# EAGLE design EtherGeiger (EAGLE 7.7.0)
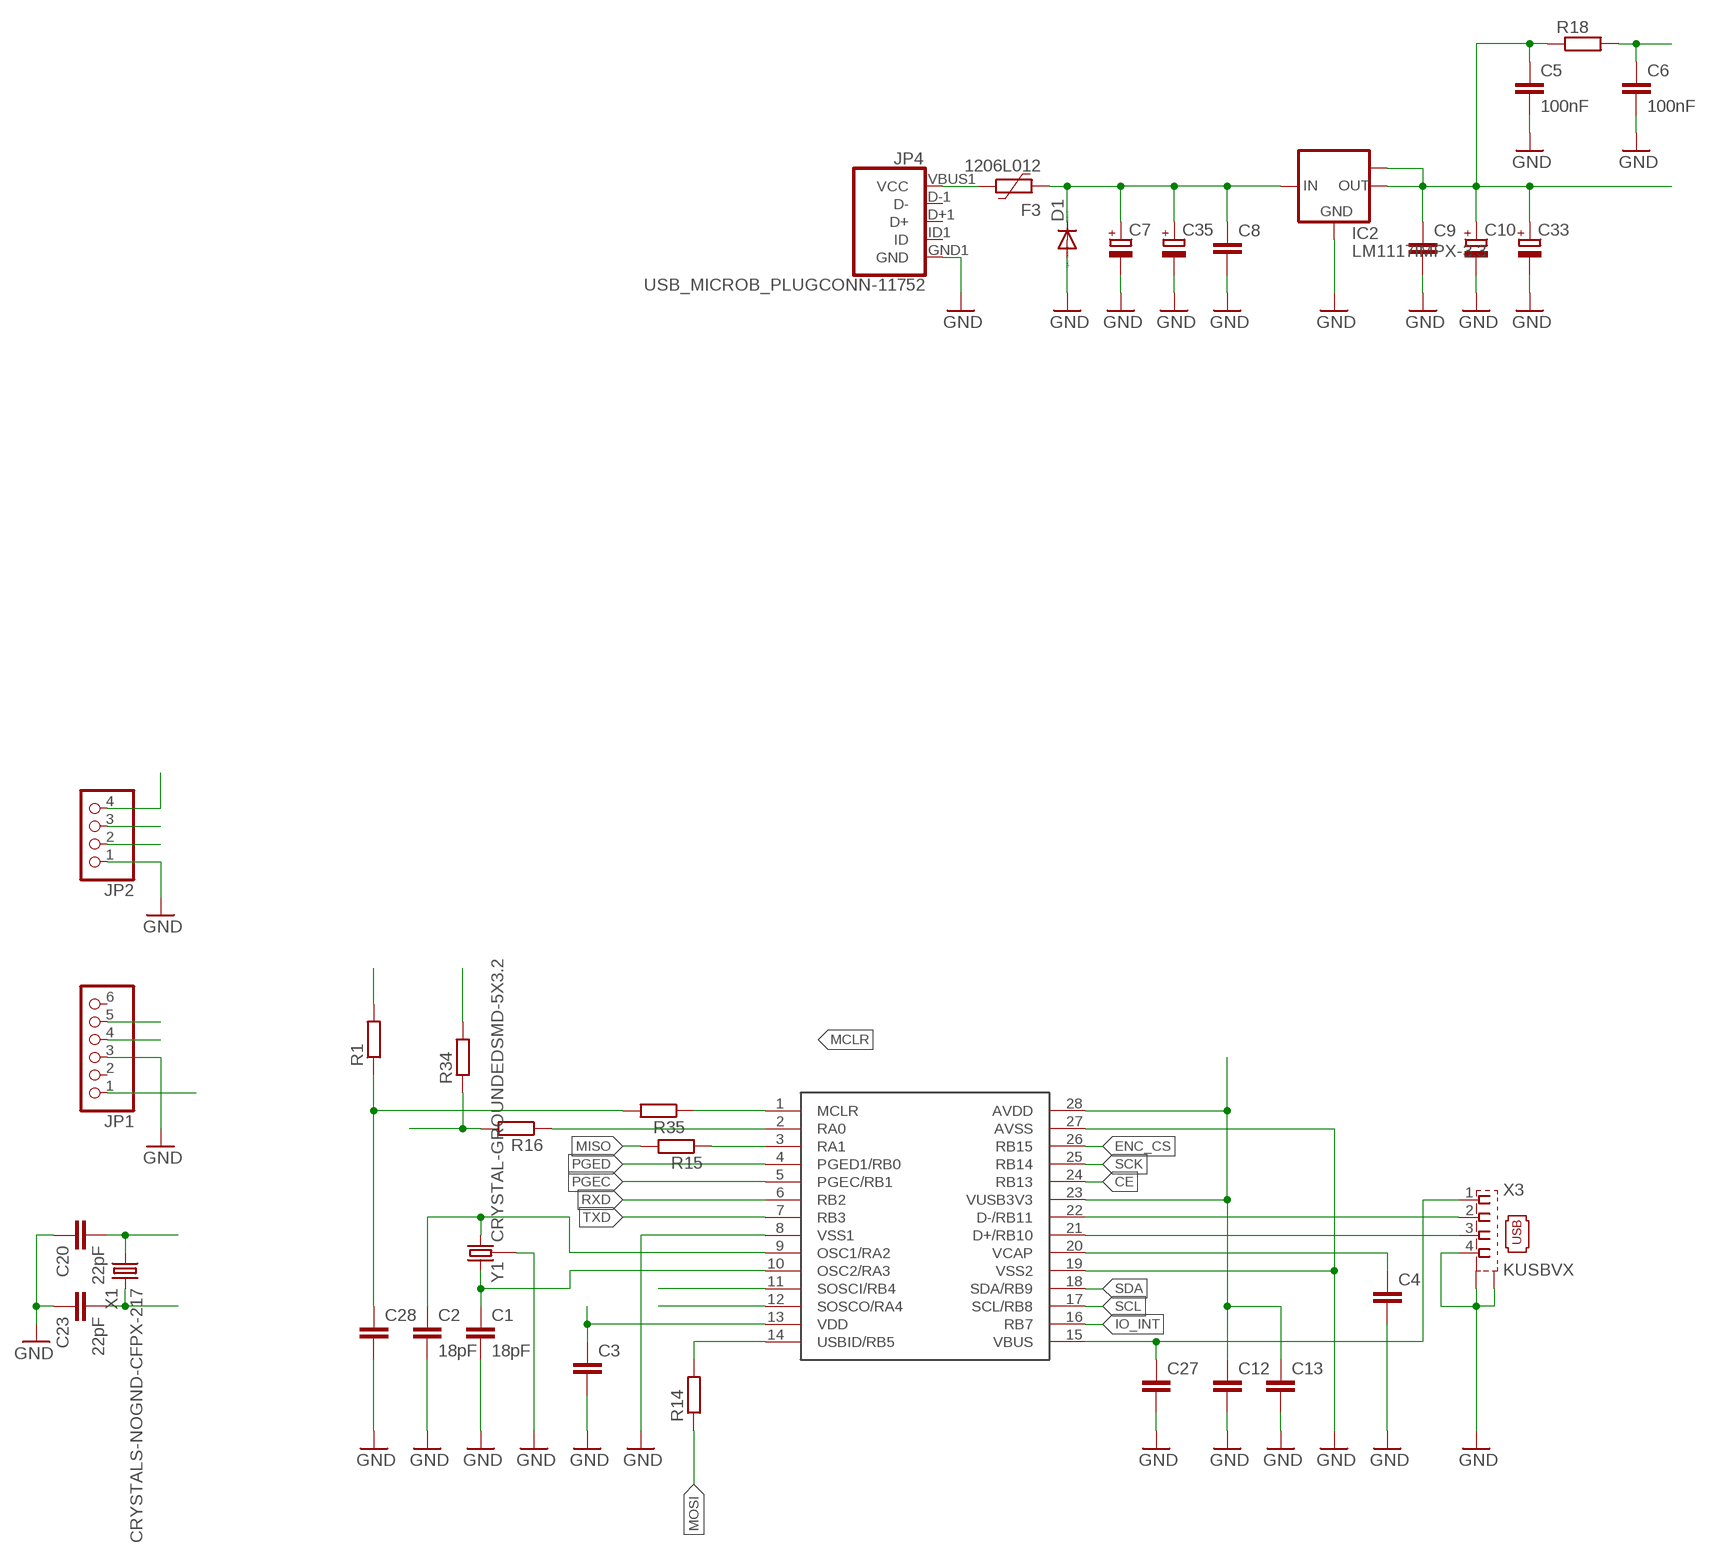
[diagram p0: schematic, sheet 1, part 1 of 3]
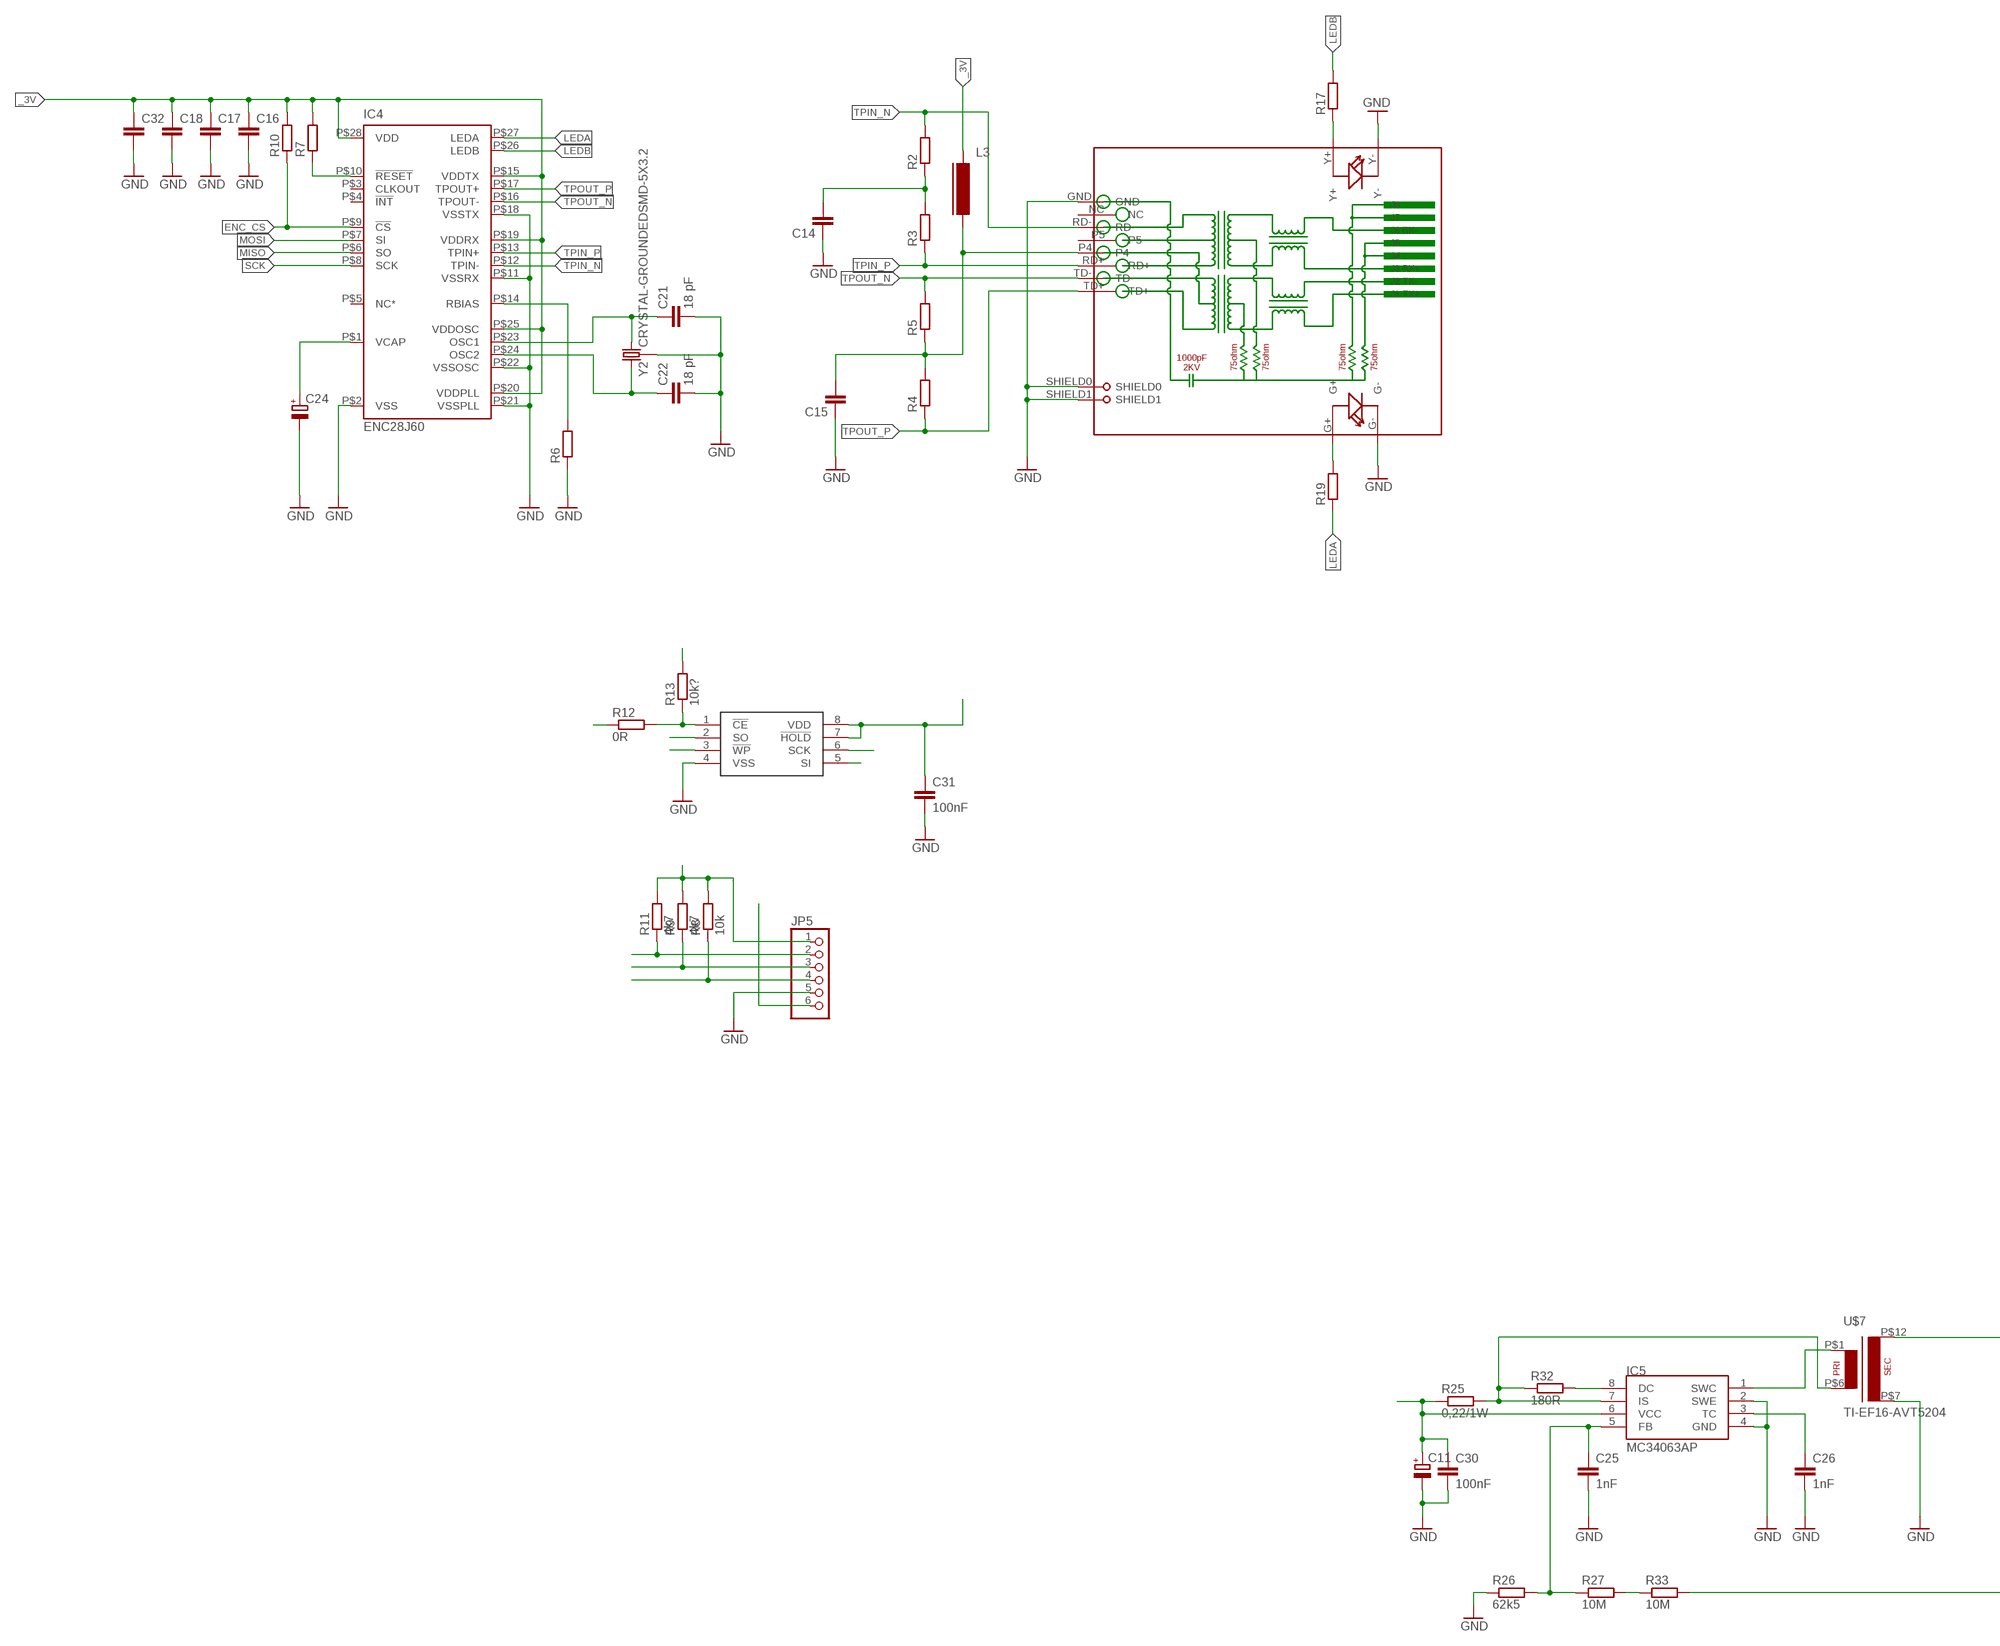
[diagram p1: schematic, sheet 1, part 2 of 3]
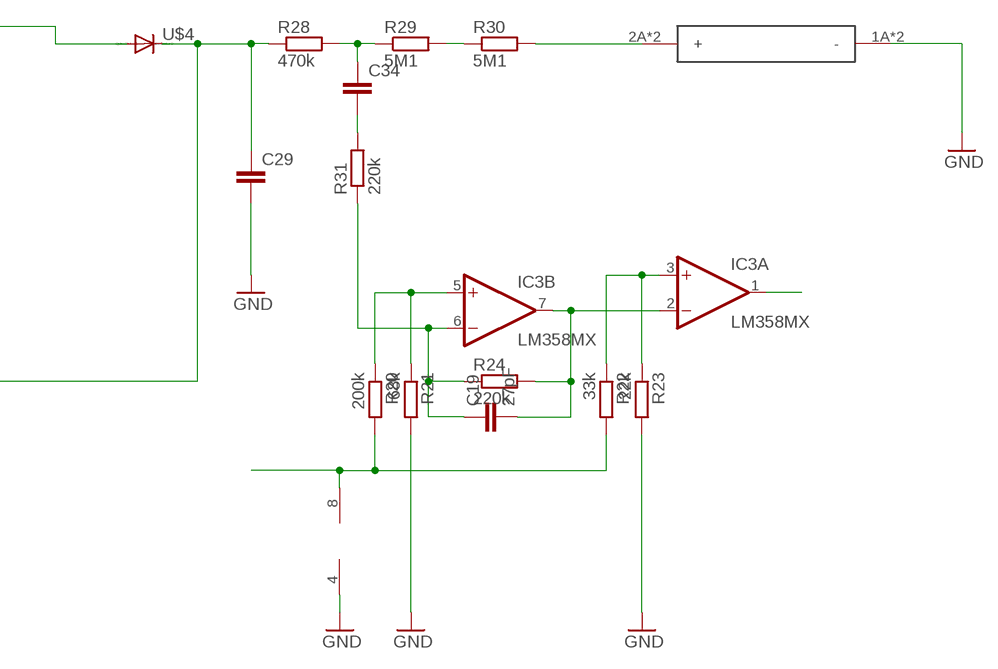
[diagram p2: schematic, sheet 1, part 3 of 3]

## Parts
C1  18pF  C-EUC0603  [C0603]
C2  18pF  C-EUC0603  [C0603]
C3  C-EUC0402  [C0402]
C4  C-EUC0603  [C0603]
C5  100nF  C-EUC0603  [C0603]
C6  100nF  C-EUC0603  [C0603]
C7  CPOL-EUSMCC  [SMC_C]
C8  C-EUC0603  [C0603]
C9  C-EUC0603  [C0603]
C10  CPOL-EUSMCB  [SMC_B]
C11  CPOL-EUSMCE  [SMC_E]
C12  C-EUC0402  [C0402]
C13  C-EUC0603  [C0603]
C14  C-EUC0603  [C0603]
C15  C-EUC0603  [C0603]
C16  C-EUC0402  [C0402]
C17  C-EUC0603  [C0603]
C18  C-EUC0603  [C0603]
C19  27pF  C-EUC0603  [C0603]
C20  22pF  C-EUC0603  [C0603]
C21  18 pF  C-EUC0603  [C0603]
C22  18 pF  C-EUC0603  [C0603]
C23  22pF  C-EUC0603  [C0603]
C24  CPOL-EUSMCA  [SMC_A]
C25  1nF  C-EUC0603  [C0603]
C26  1nF  C-EUC0603  [C0603]
C27  C-EUC0603  [C0603]
C28  C-EUC0603  [C0603]
C29  C-EU225-113X268  [C225-113X268]
C30  100nF  C-EUC0603  [C0603]
C31  100nF  C-EUC0603  [C0603]
C32  C-EUC0402  [C0402]
C33  CPOL-EUSMCA  [SMC_A]
C34  C-EU050-024X044  [C050-024X044]
C35  CPOL-EUSMCA  [SMC_A]
D1  DIODE-SMB  [SMB]
F3  1206L012  [1206L]
IC2  LM1117IMPX-3.3  [SOT223]
IC3  LM358MX  [SO08]
IC4  ENC28J60  [TSSOP28W]
IC5  MC34063AP  [DIL08]
JP1  PINHD-1X6  [1X06]
JP2  PINHD-1X4  [1X04]
JP4  USB_MICROB_PLUGCONN-11752  [USB-B-MICRO-SMD_V03]
JP5  PINHD-1X6  [1X06]
L3  FERRITE-0805  [FB805]
R1  R-EU_R0603  [R0603]
R2  R-EU_R0603  [R0603]
R3  R-EU_R0603  [R0603]
R4  R-EU_R0603  [R0603]
R5  R-EU_R0603  [R0603]
R6  R-EU_R0805  [R0805]
R7  R-EU_R0603  [R0603]
R8  10k  R-EU_R0402  [R0402]
R9  4k7  R-EU_R0402  [R0402]
R10  R-EU_R0603  [R0603]
R11  4k7  R-EU_R0402  [R0402]
R12  0R  R-EU_R0603  [R0603]
R13  10k?  R-EU_R0603  [R0603]
R14  R-EU_R0603  [R0603]
R15  R-EU_R0603  [R0603]
R16  R-EU_R1206  [R1206]
R17  R-EU_R1206  [R1206]
R18  R-EU_R1206  [R1206]
R19  R-EU_R1206  [R1206]
R20  200k  R-EU_R0603  [R0603]
R21  68k  R-EU_R0603  [R0603]
R22  33k  R-EU_R0603  [R0603]
R23  22k  R-EU_R0603  [R0603]
R24  220k  R-EU_R0603  [R0603]
R25  0,22/1W  R-EU_R2010  [R2010]
R26  62k5  R-EU_R1206  [R1206]
R27  10M  R-EU_R2512  [R2512]
R28  470k  R-EU_R2512  [R2512]
R29  5M1  R-EU_R2512  [R2512]
R30  5M1  R-EU_R2512  [R2512]
R31  220k  R-EU_M1206  [M1206]
R32  180R  R-EU_R0805  [R0805]
R33  10M  R-EU_R2512  [R2512]
R34  R-EU_R0603  [R0603]
R35  R-EU_R0603  [R0603]
RJ1  HR911105A  [HR911105A]
U$1  PIC32MX250F128B2  [SSOP28]
U$2  SST25VF016BSO8M  [SO-08M]
U$4  DIODE-MELF-MLL41  [MELF-MLL41]
U$5  STS5  [GEIGERTUBE]
U$7  TI-EF16-AVT5204  [EF16-K-H-12P-12,5]
X1  CRYSTALS-NOGND-CFPX-217  [3.2X1.5-2-PAD]
X3  KUSBVX  [KUSBVX]
Y1  CRYSTAL-GROUNDEDSMD-5X3.2  [CRYSTAL-SMD-5X3.2-4PAD]
Y2  CRYSTAL-GROUNDEDSMD-5X3.2  [CRYSTAL-SMD-5X3.2-4PAD]

## Nets
_3V: C3.1 C5.1 C9.1 C10.+ C12.1 C13.1 C16.1 C17.1 C18.1 C31.1 C32.1 C33.+ IC2.2(OUT) IC2.TAB(OUT1) IC4.P$15(VDDTX) IC4.P$19(VDDRX) IC4.P$20(VDDPLL) IC4.P$25(VDDOSC) IC4.P$28(VDD) JP2.4 JP5.1 L3.1 R1.2 R7.2 R8.2 R9.2 R10.2 R11.2 R13.2 R18.1 R34.2 U$1.13(VDD) U$1.23(VUSB3V3) U$1.28(AVDD) U$2.3(!WP) U$2.7(!HOLD) U$2.8(VDD)
_MCLR: C28.1 R1.1 R35.2
A_3V: C6.1 IC3.8(P:V+) R18.2 R20.2 R22.2
CE: R12.1 U$1.24(RB13)
CE1: R12.2 R13.1 U$2.1(!CE)
CPM: IC3.1(A:OUT) R16.2 R34.1
D_N: U$1.22(D-/RB11) X3.2
D_P: U$1.21(D+/RB10) X3.3
ENC_CS: IC4.P$9(!CS) R10.1 U$1.26(RB15)
ENC_RST: IC4.P$10(!RESET) R7.1
GND: C1.2 C2.2 C3.2 C4.2 C5.2 C6.2 C7.- C8.2 C9.2 C10.- C11.- C12.2 C13.2 C14.1 C15.1 C16.2 C17.2 C18.2 C20.1 C21.2 C22.2 C23.1 C24.- C25.2 C26.2 C27.2 C28.2 C29.2 C30.2 C31.2 C32.2 C33.- C35.- D1.A IC2.1(GND) IC3.4(P:V-) IC4.P$2(VSS) IC4.P$11(VSSRX) IC4.P$18(VSSTX) IC4.P$21(VSSPLL) IC4.P$22(VSSOSC) IC5.2(SWE) IC5.4(GND) JP1.3 JP2.1 JP4.GND1(GND) JP5.5 R6.1 R21.2 R23.2 R26.1 RJ1.G- RJ1.GND RJ1.SHIELD0 RJ1.SHIELD1 RJ1.Y- U$1.8(VSS1) U$1.19(VSS2) U$1.27(AVSS) U$2.4(VSS) U$5.1A(-) U$5.1B(-) U$7.P$7(P7) X3.4 X3.M1(S1) X3.M2(S2) Y1.2 Y1.4 Y2.2 Y2.4
HV: C29.1 R28.1 R33.2 U$4.C
IO_INT: JP5.4 R8.1 U$1.16(RB7)
LEDA: IC4.P$27(LEDA) R19.1
LEDB: IC4.P$26(LEDB) R17.2
MCLR: JP1.1 R35.1 U$1.1(MCLR)
MISO: IC4.P$6(SO) R15.2 U$2.2(SO)
MOSI: IC4.P$7(SI) R14.1 U$2.5(SI)
N$2: C14.2 R2.1 R3.2
N$4: IC5.7(IS) R25.2 R32.1 U$7.P$6(P6)
N$5: C19.1 IC3.6(B:-IN) R24.1 R31.1
N$6: C15.2 L3.2 R4.2 R5.1 RJ1.P4
N$7: C4.1 U$1.20(VCAP)
N$8: C19.2 IC3.2(A:-IN) IC3.7(B:OUT) R24.2
N$11: C26.1 IC5.3(TC)
N$12: IC4.P$14(RBIAS) R6.2
N$13: R14.2 U$1.14(USBID/RB5)
N$14: F3.1 JP4.VBUS1(VCC)
N$15: R15.1 U$1.3(RA1)
N$16: R16.1 U$1.2(RA0)
N$17: C1.1 U$1.10(OSC2/RA3) Y1.3
N$18: C2.1 U$1.9(OSC1/RA2) Y1.1
N$19: IC3.5(B:+IN) R20.1 R21.1
N$20: IC3.3(A:+IN) R22.1 R23.1
N$21: U$4.A U$7.P$12(P12)
N$22: C21.1 IC4.P$23(OSC1) Y2.1
N$23: C22.1 IC4.P$24(OSC2) Y2.3
N$24: C25.1 IC5.5(FB) R26.2 R27.1
N$25: R30.2 U$5.2A(+) U$5.2B(+)
N$26: R29.2 R30.1
N$27: C34.1 R28.2 R29.1
N$28: C34.2 R31.2
N$29: C24.+ IC4.P$1(VCAP)
N$30: R17.1 RJ1.Y+
N$31: R19.2 RJ1.G+
N$33: IC5.1(SWC) U$7.P$1(P1)
N$34: IC5.8(DC) R32.2
N$35: R27.2 R33.1
PGEC: JP1.5 U$1.5(PGEC/RB1)
PGED: JP1.4 U$1.4(PGED1/RB0)
RXD: JP2.3 U$1.6(RB2)
SCK: IC4.P$8(SCK) U$1.25(RB14) U$2.6(SCK)
SCL: JP5.3 R9.1 U$1.17(SCL/RB8)
SDA: JP5.2 R11.1 U$1.18(SDA/RB9)
SOSCI: C20.2 U$1.11(SOSCI/RB4) X1.1
SOSCO: C23.2 U$1.12(SOSCO/RA4) X1.2
TPIN_N: IC4.P$12(TPIN-) R2.2 RJ1.RD-
TPIN_P: IC4.P$13(TPIN+) R3.1 RJ1.RD+
TPOUT_N: IC4.P$16(TPOUT-) R5.2 RJ1.TD-
TPOUT_P: IC4.P$17(TPOUT+) R4.1 RJ1.TD+
TXD: JP2.2 U$1.7(RB3)
VBUS: C7.+ C8.1 C11.+ C27.1 C30.1 C35.+ D1.C F3.2 IC2.3(IN) IC5.6(VCC) JP5.6 R25.1 U$1.15(VBUS) X3.1
Unconnected: IC4.P$3(CLKOUT) IC4.P$4(!INT) IC4.P$5(NC*) JP1.2 JP1.6 JP4.D+1(D+) JP4.D-1(D-) JP4.ID1(ID) RJ1.NC RJ1.P5

## Library data of the parts
C1-C6 C8 C9 C12-C23 C25-C32 C34 = rcl:C-EU: CAPACITOR, European symbol
C7 C10 C11 C24 C33 C35 = rcl:CPOL-EU: POLARIZED CAPACITOR, European symbol
D1 U$4 = diode:DIODE-: DIODE
F3 = polyfuse-smd_10:?: Polyfuse Resettable PTC Source: http://www.littelfuse.com/products/resettable-ptcs.aspx; MF: Littelfuse; MPN: 1206L012; OC_FARNELL: 1596988; OC_NEWARK: 05M2298
IC2 = lm1117:LM1117IMPX-*
IC3 = linear:LM358: OP AMP also LM158; LM258; LM2904 Source: http://cache.national.com/ds/LM/LM158.pdf
IC4 = microchip:ENC28J60: Stand-Alone Ethernet Controller with SPI Interface Source: http://ww1.microchip.com/downloads/en/DeviceDoc/39662c.pdf
IC5 = mc34063:MC34063
JP1 JP5 = pinhead:PINHD-1X6: PIN HEADER
JP2 = pinhead:PINHD-1X4: PIN HEADER
JP4 = SparkFun-Connectors:USB_MICROB_PLUG: USB Micro-B connectors Some male, some female. Watch your step!; PROD_ID: CONN-11752
L3 = dp_devices:FERRITE: Ferrite bead in various packages
R1-R35 = rcl:R-EU_: RESISTOR, European symbol
RJ1 = hanrun:HR911105A
U$1 = microchip-pic32mx:PIC32MX250F128B
U$2 = mw:SST25VF016B
U$5 = mw:STS5
U$7 = trafo:TI-EF16-AVT5204
X1 = IQD-Frequency-Products:CRYSTALS-NOGND: CRYSTALS CAN NOT GROUNDED
X3 = con-kycon:KUSBVX: Vertical,Top Entry Universal Serial Bus Connector KUSBVX Series Source: KYCON Sibalco USB vertical socket KUSBV.pdf
Y1 Y2 = SparkFun-Clocks:CRYSTAL-GROUNDED: Crystals w/ Ground Pin (Generic) These are passive quartz crystals, which can be used as a clock source for a microcontroller. Crystal's are usually two-terminal devices. A third terminal may be optionally connected to ground, as recommended by the manufaturer.

## Board
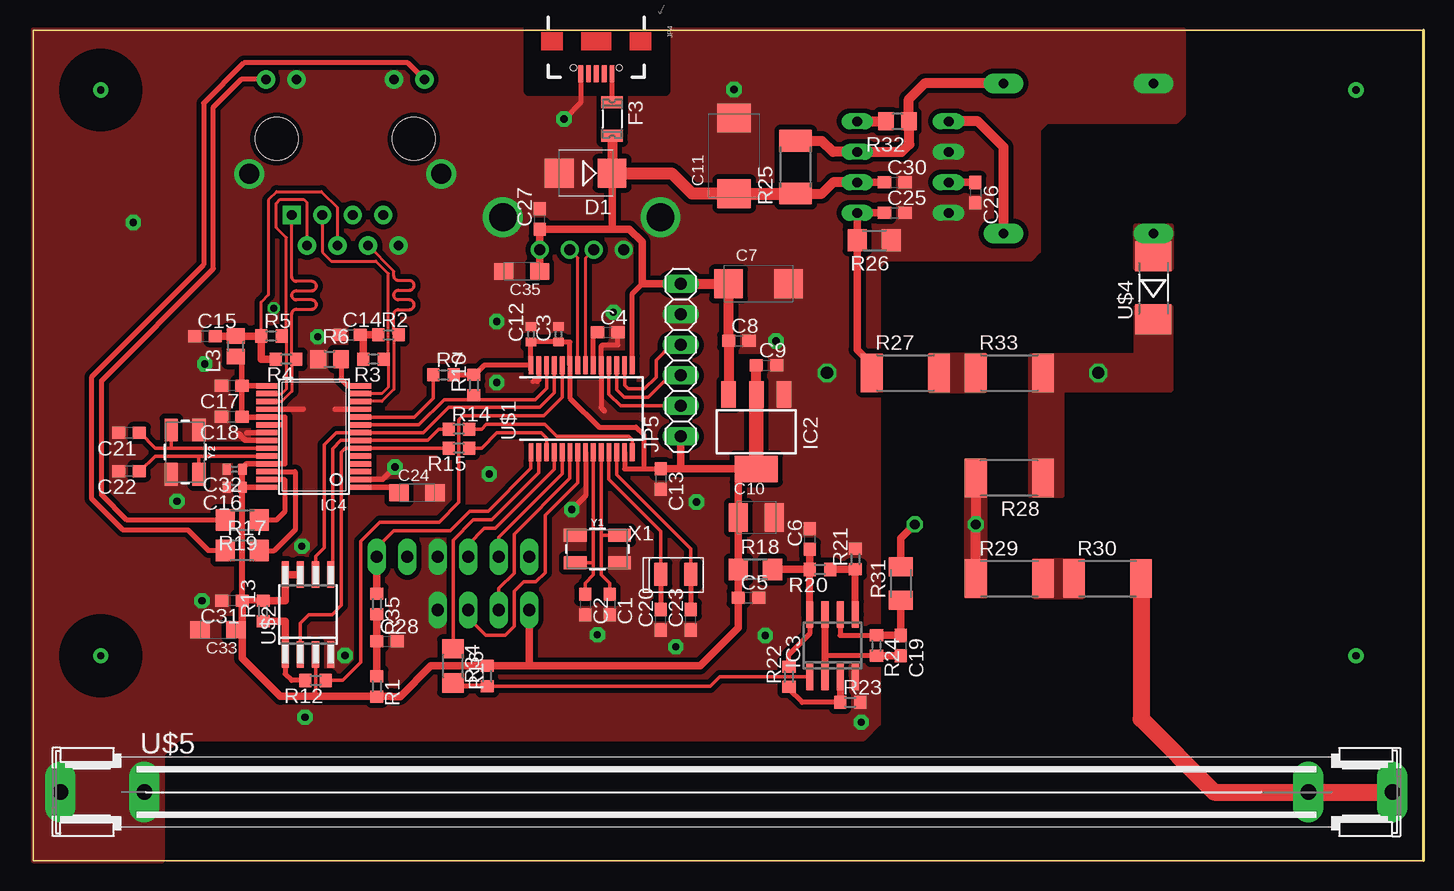
[diagram p3: board, top side]
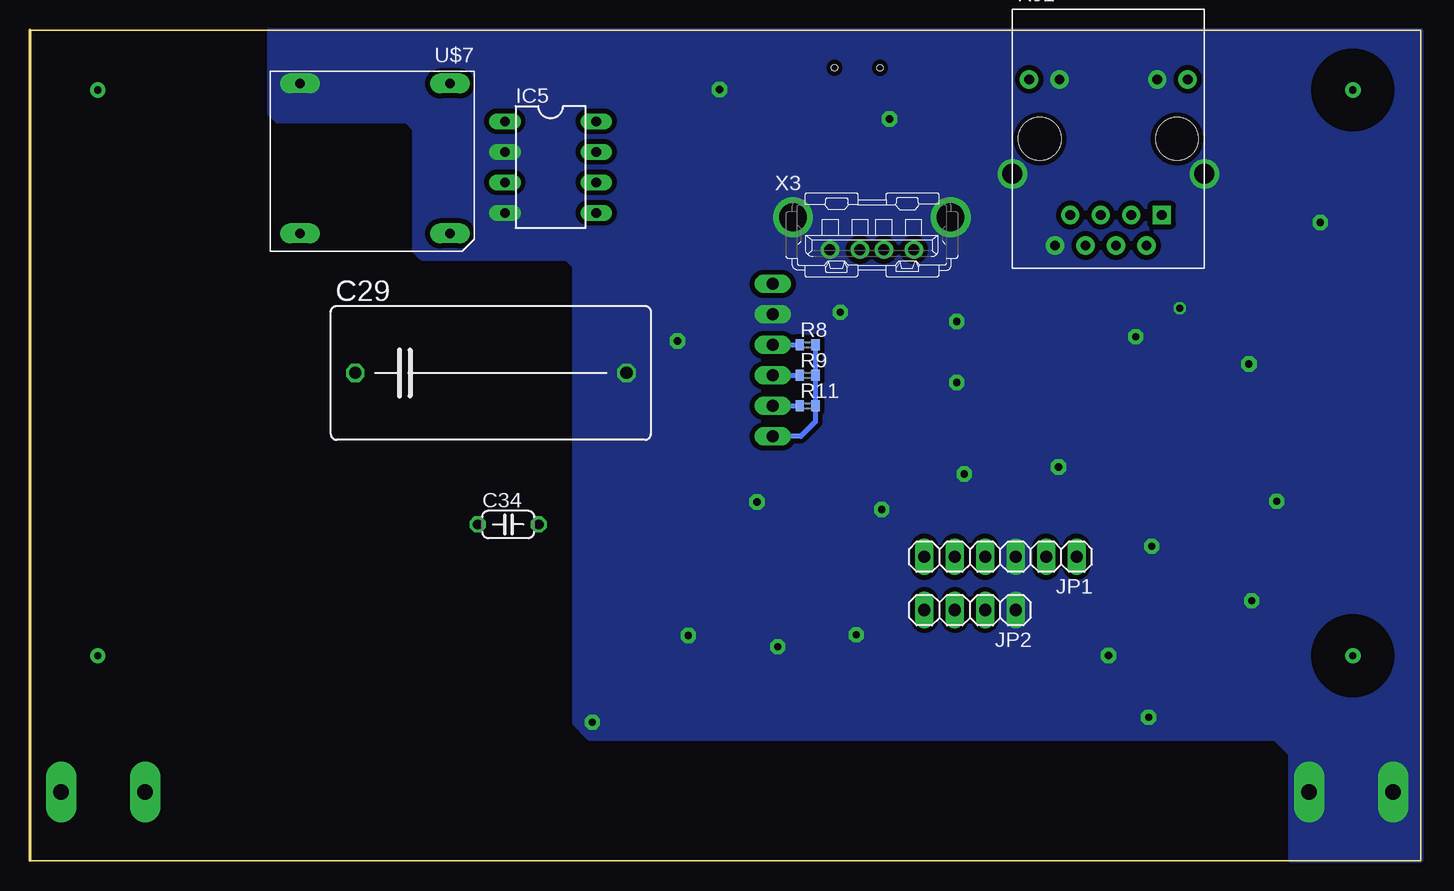
[diagram p4: board, bottom side, seen from below]

Size 115.88 x 69.22 mm. Coordinates in mm from the lower left corner, seen from the top.
Outline: 0,0 115.88,0 115.88,69.22 0,69.22 0,0
Copper layers (1*16): Top 0.035mm / dielectric 1.5mm / Bottom 0.035mm
Design rules "default *": minimum track width 10mil, minimum drill 24mil, track to track 8mil, track to pad 8mil, pad to pad 8mil, via to via 8mil, smd to smd 8mil, copper to edge 0mil, drill to drill 8mil, minimum pad ring 10mil, minimum via ring 8mil, stop-mask expansion 4mil, vias tented up to drill 0mil, thermal gap 10mil
tRestrict: area 18.5,30.9 to 20.3,39.8; area 26.4,30.9 to 28.2,39.8; area 41.3,40.5 to 50.1,42.1; area 41.3,33.3 to 50.1,34.8; area 45.4,48.8 to 46,49.8; area 2.6,14 to 8.7,20.1; area 2.6,61.2 to 8.7,67.3; area 41.3,64.1 to 52.7,69.2
bRestrict: area 2.6,14 to 8.7,20.1; area 2.6,61.2 to 8.7,67.3

### Footprints (pad centres in the part's own frame; a part is rotated, then mirrored left to right if it is on the bottom)
C0603 = smd 1.1 x 1: 1 -0.85,0; 2 0.85,0
C0402 = smd 0.7 x 0.9: 1 -0.65,0; 2 0.65,0
SMC_C = smd 2.4 x 2.4: + -2.5,0; - 2.5,0
SMC_B = smd 1.6 x 2.4: + -1.5,0; - 1.5,0
SMC_E = smd 2.4 x 2.8: + -3.15,0; - 3.15,0
SMC_A = smd 1.6 x 1.4: + -1.5,0; - 1.5,0
C225-113X268 = drill 1.016 octagon: 1 -11.303,0; 2 11.303,0
C050-024X044 = drill 0.813 octagon: 1 -2.54,0; 2 2.54,0
SMB = smd 2.4 x 2.4: A 2.2,0; C -2.2,0
1206L = smd 1 x 1.8: 1 -1.4,0; 2 1.4,0
SOT223 = smd 1.219 x 2.235: 1 -2.311,-3.099; 2 0,-3.099; 3 2.311,-3.099 | smd 3.6 x 2.2: TAB 0,3.099
SO08 = smd 0.6 x 2.2: 1 -1.905,-2.6; 2 -0.635,-2.6; 3 0.635,-2.6; 4 1.905,-2.6; 5 1.905,2.6; 6 0.635,2.6; 7 -0.635,2.6; 8 -1.905,2.6
TSSOP28W = smd 0.45 x 1.75: P$1 0,-0.65; P$2 0.65,-0.65; P$3 1.3,-0.65; P$4 1.95,-0.65; P$5 2.6,-0.65; P$6 3.25,-0.65; P$7 3.9,-0.65; P$8 4.55,-0.65; P$9 5.2,-0.65; P$10 5.85,-0.65; P$11 6.5,-0.65; P$12 7.15,-0.65; P$13 7.8,-0.65; P$14 8.45,-0.65; P$15 8.45,7.2; P$16 7.8,7.2; P$17 7.15,7.2; P$18 6.5,7.2; P$19 5.85,7.2; P$20 5.2,7.2; P$21 4.55,7.2; P$22 3.9,7.2; P$23 3.25,7.2; P$24 2.6,7.2; P$25 1.95,7.2; P$26 1.3,7.2; P$27 0.65,7.2; P$28 0,7.2
DIL08 = drill 0.813 long: 1 -3.81,-3.81; 2 -1.27,-3.81; 3 1.27,-3.81; 4 3.81,-3.81; 5 3.81,3.81; 6 1.27,3.81; 7 -1.27,3.81; 8 -3.81,3.81
1X06 = drill 1.016 long: 1 -6.35,0; 2 -3.81,0; 3 -1.27,0; 4 1.27,0; 5 3.81,0; 6 6.35,0
1X04 = drill 1.016 long: 1 -3.81,0; 2 -1.27,0; 3 1.27,0; 4 3.81,0
USB-B-MICRO-SMD_V03 = smd 1.4 x 0.4: D+1 2.7,0; D-1 2.7,0.65; GND1 2.7,-1.3; ID1 2.7,-0.65; VBUS1 2.7,1.3 | hole 0.5: 2.2,1.9; 2.2,-1.9
FB805 = smd 1.3 x 1.5: 1 -0.85,0; 2 0.85,0
R0603 = smd 1 x 1.1: 1 -0.85,0; 2 0.85,0
R0805 = smd 1.3 x 1.5: 1 -0.95,0; 2 0.95,0
R0402 = smd 0.7 x 0.9: 1 -0.65,0; 2 0.65,0
R1206 = smd 1.6 x 1.803: 1 -1.422,0; 2 1.422,0
R2010 = smd 1.8 x 2.7: 1 -2.2,0; 2 2.2,0
R2512 = smd 1.8 x 3.2: 1 -2.8,0; 2 2.8,0
M1206 = smd 1.6 x 2: 1 -1.4,0; 2 1.4,0
HR911105A = drill 0.813 pad 1.524: G+ 4.953,-6.604; G- 4.953,-4.064; GND -8.89,4.445; NC -6.35,3.175; P4 -8.89,-0.635; P5 -6.35,0.635; RD+ -6.35,-1.905; RD- -8.89,1.905; TD- -8.89,-3.175; Y+ 4.953,6.604; Y- 4.953,4.064 | drill 1.651 pad 2.159: SHIELD0 -2.921,8.001; SHIELD1 -2.921,-8.001 | drill 0.813 pad 1.524 square: TD+ -6.35,-4.445 | hole 3.556: 0,-5.715; 0,5.715
SSOP28 = smd 0.4 x 1.5: 1 -4.225,-3.625; 2 -3.575,-3.625; 3 -2.925,-3.625; 4 -2.275,-3.625; 5 -1.625,-3.625; 6 -0.975,-3.625; 7 -0.325,-3.625; 8 0.325,-3.625; 9 0.975,-3.625; 10 1.625,-3.625; 11 2.275,-3.625; 12 2.925,-3.625; 13 3.575,-3.625; 14 4.225,-3.625; 15 4.225,3.625; 16 3.575,3.625; 17 2.925,3.625; 18 2.275,3.625; 19 1.625,3.625; 20 0.975,3.625; 21 0.325,3.625; 22 -0.325,3.625; 23 -0.975,3.625; 24 -1.625,3.625; 25 -2.275,3.625; 26 -2.925,3.625; 27 -3.575,3.625; 28 -4.225,3.625
SO-08M = smd 0.6 x 2.2: 1 -1.905,-3.33; 2 -0.635,-3.33; 3 0.635,-3.33; 4 1.905,-3.33; 5 1.905,3.33; 6 0.635,3.33; 7 -0.635,3.33; 8 -1.905,3.33
MELF-MLL41 = smd 2.5 x 3: A 2.625,0; C -2.625,0
GEIGERTUBE = drill 1.321 pad 2.54 long: 1A -10.414,0; 1B -3.414,0; 2A 93.586,0; 2B 100.586,0
EF16-K-H-12P-12,5 = drill 0.8 pad 1.676 long: P$1 0,12.5; P$6 0,0; P$7 12.5,0; P$12 12.5,12.5
3.2X1.5-2-PAD = smd 1.1 x 1.9: 1 -1.25,0; 2 1.25,0
KUSBVX = drill 0.9 pad 1.524: 1 3.5,0; 2 1,0; 3 -1,0; 4 -3.5,0 | drill 2.3 pad 2.8: M1 -6.57,2.71; M2 6.57,2.71
CRYSTAL-SMD-5X3.2-4PAD = smd 1.9 x 1.1: 1 -1.85,-1.15; 2 1.85,-1.15; 3 1.85,1.15; 4 -1.85,1.15

### Placement (x,y rotation side)
C1  48.04,21.34 270 top
C2  46.02,21.34 270 top
C3  43.79,43.87 90 top
C4  47.89,44.02 0 top
C5  59.61,21.92 0 top
C6  64.74,26.8 90 top
C7  60.45,48.06 0 top
C8  58.81,43.31 0 top
C9  61.12,41.28 0 top
C10  60.28,28.6 0 top
C11  58.42,58.72 90 top
C12  41.5,43.85 90 top
C13  52.3,31.79 270 top
C14  26.42,43.81 0 top
C15  14.33,43.71 0 top
C16  16.79,31.12 180 top
C17  16.56,39.56 180 top
C18  16.56,36.97 180 top
C19  72.31,17.91 270 top
C20  52.32,20.07 90 top
C21  8,35.64 180 top
C22  8,32.45 180 top
C23  54.82,20.07 90 top
C24  31.99,30.64 0 top
C25  71.81,53.98 0 top
C26  78.54,55.66 270 top
C27  42.22,53.47 90 top
C28  29.5,18.26 0 top
C29  77.47,40.64 0 bottom
C30  71.81,56.52 0 top
C31  16.59,21.65 180 top
C32  16.79,32.61 180 top
C33  15.42,19.23 180 top
C34  76.02,28.02 0 bottom
C35  40.72,49.1 180 top
D1  46.05,57.28 180 top
F3  48.26,61.8 270 top
IC2  60.27,35.74 180 top
IC3  66.62,17.91 0 top
IC4  26.67,31.12 90 top
IC5  72.49,57.79 270 bottom
JP1  35,25.32 180 bottom
JP2  37.54,20.88 180 bottom
JP4  46.94,68.28 270 top
JP5  53.98,41.71 90 top
L3  16.89,42.86 90 top
R1  28.65,14.52 270 top
R2  29.62,43.81 0 top
R3  28.37,41.78 180 top
R4  21.09,41.78 180 top
R5  19.86,43.71 0 top
R6  24.71,41.78 0 top
R7  34.2,40.47 0 top
R8  51.08,42.98 0 bottom
R9  51.08,40.44 0 bottom
R10  36.73,39.62 90 top
R11  51.08,37.9 0 bottom
R12  23.55,15.01 180 top
R13  19.18,20.8 90 top
R14  35.48,35.95 0 top
R15  35.48,34.37 180 top
R16  35,16.22 270 top
R17  17.44,25.83 0 top
R18  60.2,24.26 0 top
R19  17.44,28.37 180 top
R20  65.58,24.26 180 top
R21  68.53,25.12 90 top
R22  62.99,15.32 90 top
R23  68.1,13.18 0 top
R24  70.28,17.91 270 top
R25  63.55,57.79 90 top
R26  70.1,51.69 180 top
R27  72.69,40.64 0 top
R28  81.36,31.88 180 top
R29  81.36,23.5 0 top
R30  89.53,23.5 0 top
R31  72.31,23.09 90 top
R32  72.03,61.59 180 top
R33  81.36,40.64 0 top
R34  37.85,15.37 90 top
R35  28.65,21.39 270 top
RJ1  26.01,60.15 90 bottom
U$1  45.72,37.67 0 top
U$2  22.91,20.5 0 top
U$4  93.37,47.73 90 top
U$5  12.7,5.72 0 top
U$7  80.87,64.77 180 bottom
X1  53.57,23.85 0 top
X3  45.72,50.9 0 bottom
Y1  47.03,25.96 0 top
Y2  12.67,34.04 270 top

### Tracks (layer width: path | path; a pad name or v marks a point on that pad's centre or on a via)
_3V
  Top 0.305: U$2.3 23.55,13.68 | R1.2 29.86,13.67 29.84,13.68 | C10.+ 58.78,28.58 58.78,28.57
  Top 0.406: U$1.13 49.3,32.64 50.88,32.64 | 50.88,32.64 50.88,35.51 50.27,36.12 47.17,36.12 44.75,38.54 U$1.23 44.75,43.22 C3.1 41.51,43.22 C12.1 U$1.28 | 41.5,40.86 U$1.28 | U$1.28 37.61,41.29 36.79,40.47 R10.2 R7.2 | 50.88,32.64 C13.1 | R18.1 58.78,24.13 | C5.1 58.76,21.6 58.78,21.59 | C33.+ 17.26,19.23 17.44,19.05 | R34.2 38.1,16.22
  Top 0.457: IC4.P$20 20.98,36.31 | 20.98,36.31 20.98,33.06 IC4.P$25 17.8,33.06 17.44,32.7 C32.1 | IC4.P$28 C16.1 | 20.98,36.31 20.98,36.97 IC4.P$19 C18.1 C17.1 | L3.1 17.36,41.54 17.41,41.54 C17.1 | IC4.P$15 C17.1
  Top 0.508: C32.1 C16.1 C31.1 R13.2
  Top 0.61: R13.2 21.01,21.65 U$2.8 U$2.7 | C31.1 17.44,19.05 17.44,16.85 20.61,13.68 23.55,13.68 29.84,13.68 | 41.35,16.22 38.1,16.22 33.15,16.23 30.58,13.67 29.86,13.67 | JP2.4 41.35,16.22 | 41.35,16.22 55.59,16.22 58.78,19.41 58.78,21.59 58.78,24.13 58.78,28.57 58.78,32.64 | 58.78,32.64 IC2.TAB | 58.78,32.64 53.98,32.64 | 53.98,32.64 C13.1 | JP5.1 53.98,32.64
  Top 0.813: IC2.2 C9.1
  Top 1.219: IC2.TAB IC2.2
  Bottom 0.406: R8.2 R9.2 R11.2 50.43,36.57 51.64,35.36 JP5.1
_MCLR
  Top 0.61: R35.2 28.65,20.32 | 28.65,20.32 R1.1 | C28.1 28.65,18.41 28.65,20.32
A_3V
  Top 0.406: IC3.8 64.72,18.9 62.99,17.17 R22.2
  Top 0.599: IC3.8 64.72,24.24 R20.2
  Top 0.61: R18.2 R20.2 64.73,25.94 C6.1
CE
  Top 0.305: U$1.24 44.1,38.61 42.55,37.06 35.79,37.06 35.48,36.75 35.48,29.84 33.83,28.19 28.91,28.19 27.3,26.59 27.3,16.51 25.81,15.01 R12.1
CE1
  Top 0.406: R12.2 21.54,15.01 21.01,15.55 U$2.1
  Top 0.61: R13.1 21.01,19.95 U$2.1
CPM
  Top 0.305: IC3.1 57.23,15.32 56.43,14.52 R34.1
  Top 0.406: R34.1 35.28,14.52 R16.2
D_N
  Top 0.254: U$1.22 45.4,50.23 X3.2
D_P
  Top 0.254: U$1.21 46.05,50.23 X3.3
ENC_CS
  Top 0.305: U$1.26 42.8,39.37 41.85,38.42 36.83,38.42 | 36.83,38.42 34.26,38.42 32.15,36.31 IC4.P$9 | R10.1 36.73,38.53 36.83,38.42
ENC_RST
  Top 0.305: IC4.P$10 31.78,36.97 33.35,38.53 R7.1 33.35,40.44
GND  (via drill 0.6 pad 1.02, 0.6 pad 1.27)
  Top 0.399: JP4.GND1 45.64,63.19 v44.25,61.8
  Top 0.406: U$1.27 42.15,40.04 42.04,39.93 41.66,39.93 | U$1.8 46.05,30.4 v44.9,29.25 | C4.2 48.74,42.98 47.47,42.98 47.35,42.85 U$1.19 47.35,37.75 47.62,37.47
  Top 0.457: IC4.P$11 25.17,37.62 | IC4.P$18 22.51,37.62 | IC4.P$21 17.8,35.66 | IC4.P$22 17.69,35.02 17.14,35.56 | IC4.P$2 29.14,31.77 v30.16,32.79
  other vias: 20.07,46.02 11.99,29.95 14.3,41.38 23.72,43.66 48.36,45.69 26,17.09 38.65,39.84 38.01,32.22 22.4,26.19 47.03,18.81 53.57,17.82 55.29,29.89 38.65,44.92 61.91,43.31 58.42,64.26 8.36,53.18 14.07,21.65 69.01,11.52 22.66,11.94 61.01,18.76
  pour Top (isolate 0.406, rank 2, no thermals): 0,69.22 0,0 10.79,0 10.79,8.89 12.06,10.16 69.21,10.16 70.48,11.43 70.48,49.53 71.12,50.16 83.19,50.16 83.82,50.8 83.82,60.96 84.45,61.59 95.25,61.59 95.88,62.23 95.88,69.22
  pour Bottom (isolate 0.406, no thermals): 0,69.22 0,0 10.79,0 10.79,8.89 12.06,10.16 69.21,10.16 70.48,11.43 70.48,49.53 71.12,50.16 83.19,50.16 83.82,50.8 83.82,60.96 84.45,61.59 95.25,61.59 95.88,62.23 95.88,69.22
HV
  pour Top (isolate 0.406, no thermals): 83.08,42.06 83.08,30.43 85.75,30.43 85.75,39.24 94.84,39.24 94.84,46.15 91.9,46.15 91.9,42.06
IO_INT
  Top 0.305: U$1.16 49.3,39.61 49.58,39.32 50.95,39.32 51.92,40.28 51.92,41.71 53.19,42.98 JP5.4
  Bottom 0.406: JP5.4 R8.1
LEDA
  Top 0.406: IC4.P$27 20.95,31.77 20.95,29.06 20.27,28.37 R19.1
LEDB
  Top 0.406: IC4.P$26 21.84,32.41 21.84,27.56 20.12,25.83 R17.2
MCLR
  Top 0.305: JP1.1 28.65,26.06 30.07,27.48 34.77,27.48 36.4,29.11 37.92,29.11 41.5,32.68 U$1.1
  Top 0.61: R35.1 JP1.1
MISO
  Top 0.305: U$2.2 22.28,19.79 22.99,20.5 24.92,20.5 25.68,21.26 25.68,34.04 26.01,34.37 IC4.P$6 R15.2
MOSI
  Top 0.305: U$2.5 24.96,23.25 24.96,34.34 25.64,35.02 IC4.P$7 32.88,35.02 33.81,35.95 R14.1
N$1
  cutout Top: 46.95,63.7 46.95,60.53 49.57,60.53 49.57,63.7
N$2
  Top 0.61: R3.2 27.52,43.63 27.45,43.63 C14.2 R2.1
N$3
  cutout Top: 58.42,42.18 59.69,42.18 59.69,41.27 58.42,41.27
N$4
  Top 0.61: 73.02,61.55 R32.1
  Top 0.813: 73.02,61.55 73.02,59.69 72.39,59.05 IC5.7 66.67,59.05 65.74,59.98 R25.2 | U$7.P$6 74.3,64.77 72.98,63.46 R32.1
N$5
  Top 0.406: IC3.6 67.26,18.76 R24.1
  Top 0.61: R24.1 C19.1 R31.1
N$6
  Top 0.254: RJ1.P4 25.38,54.41 24.03,55.75 20.29,55.75 19.61,55.07 19.61,47.14 19.01,46.55 R5.1
  Top 0.61: R4.2 19.01,41.78 R5.1 L3.2 | L3.2 | C15.2 L3.2
N$7
  Top 0.406: U$1.20 46.7,43.67 C4.1
N$8
  Top 0.406: R24.2 65.99,17.06
  Top 0.599: IC3.7 65.99,17.06 IC3.2
  Top 0.61: C19.2 R24.2
N$11
  Top 0.61: IC5.3 C26.1
N$12
  Top 0.406: IC4.P$14 26.22,39.56 25.66,40.12 R6.2
N$13
  Top 0.305: U$1.14 49.95,35.07 49.66,35.36 43.64,35.36 42.65,36.35 37.77,36.35 37.37,35.95 R14.2
N$14
  Top 0.399: JP4.VBUS1 48.24,63.22 F3.1
  Top 0.813: 48.36,63.2 F3.1
N$15
  Top 0.305: U$1.3 42.8,35.18 42.34,35.64 38.66,35.64 37.39,34.37 R15.1
N$16
  Top 0.305: R16.1 35,26.7 36.7,28.4 38.23,28.4 42.15,32.31 U$1.2
N$17
  Top 0.305: U$1.10 47.35,27.11 | 47.35,27.11 47.35,23.83 48.04,23.13 C1.1 | Y1.3 47.35,27.11
N$18
  Top 0.305: U$1.9 46.7,24.81 | 46.7,24.81 46.7,23.81 46.02,23.13 C2.1 | Y1.1 46.7,24.81
N$19
  Top 0.599: IC3.5 R21.1
  Top 0.61: R20.1 68.52,24.26 R21.1
N$20
  Top 0.406: R23.1 64.08,13.18 62.99,14.28 R22.1
  Top 0.599: IC3.3 67.26,13.19 R23.1
N$21
  pour Top (isolate 0.406, no thermals): 94.84,52.91 94.84,49.3 91.9,49.3 91.9,52.91
N$22
  Top 0.305: IC4.P$23 11.53,34.37 | 11.53,34.37 10.19,34.37 8.92,35.64 C21.1 | Y2.1 11.53,34.37
N$23
  Top 0.305: IC4.P$24 13.82,33.72 | 13.82,33.72 10.17,33.72 8.9,32.45 C22.1 | Y2.3 13.82,33.72
N$24
  Top 0.406: 69.85,40.66 R27.1
  Top 0.61: 69.85,40.66 69.85,41.4 68.68,42.57 68.68,52.07 | C25.1 IC5.5 68.68,52.07 | R26.2 68.68,52.07 | 68.68,52.07
N$25
  Top 1.422: R30.2 92.33,11.8 98.42,5.72 U$5.2A U$5.2B
N$26
  pour Top (isolate 0.406, no thermals): 83.41,24.99 83.41,22 87.48,22 87.48,24.99
N$27
  Top 0.813: R28.2 C34.1 R29.1
  pour Top (no thermals): 77.8,33.35 79.32,33.35 79.32,22.02 77.8,22.02
N$28
  Top 0.61: R31.2 72.31,26.85 C34.2
N$29
  Top 0.457: IC4.P$1 30.02,31.12 C24.+
N$30
  Top 0.406: RJ1.Y+ 31.24,66.47 17.58,66.47 14.22,63.12 14.22,49.66 4.9,40.34 4.9,30.15 7.49,27.56 12.9,27.56 14.63,25.83 R17.1
N$31
  Top 0.406: R19.2 7.82,28.37 5.71,30.48 5.71,40 15.04,49.33 15.04,62.79 17.35,65.1 RJ1.G+
N$32
  cutout Top: 61.79,56.49 65.31,56.49 65.31,59.08 61.79,59.08
N$33
  Top 0.813: U$7.P$1 80.87,59.46 78.74,61.59 IC5.1
N$34
  Top 0.813: IC5.8 R32.2
N$35
  pour Top (isolate 0.406, no thermals): 74.73,42.11 74.73,39.17 79.32,39.17 79.32,42.11
N$36  (via drill 0.6 pad 1.27)
  other vias: 5.63,64.22
N$37  (via drill 0.6 pad 1.27)
  other vias: 5.63,17.07
N$38  (via drill 0.6 pad 1.27)
  other vias: 110.24,17.07
N$39  (via drill 0.6 pad 1.27)
  other vias: 110.24,64.22
PGEC
  Top 0.305: U$1.5 44.1,32.23 38.81,26.95 JP1.5
PGED
  Top 0.305: U$1.4 43.45,32.6 38.53,27.69 37.62,27.69 36.27,26.34 JP1.4
RXD
  Top 0.305: U$1.6 44.75,31.87 40.08,27.2 40.08,23.95 38.81,22.68 JP2.3
SCK
  Top 0.305: U$1.25 43.45,38.98 42.24,37.77 34.62,37.77 32.52,35.66 IC4.P$8 25.28,35.66 24.26,34.65 24.26,26.06 23.55,25.35 U$2.6
SCL
  Top 0.305: U$1.17 48.65,39.24 49.28,38.61 51.26,38.61 53.09,40.44 JP5.3
  Bottom 0.406: JP5.3 R9.1
SDA
  Top 0.305: U$1.18 48,38.87 48.97,37.9 JP5.2
  Bottom 0.406: JP5.2 R11.1
SOSCI
  Top 0.305: U$1.11 48,31.76 52.32,27.44 X1.1
  Top 0.406: X1.1 C20.2
SOSCO
  Top 0.305: U$1.12 48.65,32.15 54.82,25.98 X1.2
  Top 0.406: X1.2 C23.2
TPIN_N
  Top 0.254: IC4.P$12 29.06,38.27 30.07,39.28 30.07,43.84 | RJ1.RD- 30.07,49.1 30.07,48.72 arc90 30.45,48.34 31.37,48.34 arc-90 31.75,47.95 31.75,47.91 arc-90 31.37,47.53 30.45,47.53 arc90 30.07,47.15 30.07,47.1 arc90 30.45,46.72 31.37,46.72 arc-90 31.75,46.34 31.75,46.3 arc-90 31.37,45.92 30.45,45.92 arc90 30.07,45.54 30.07,43.84 | R2.2 30.1,43.81 30.07,43.84
TPIN_P
  Top 0.254: IC4.P$13 29.07,38.91 29.62,39.47 29.62,42.09 | 29.62,42.09 29.62,48.92 28.57,49.96 24.84,49.96 24.11,50.7 RJ1.RD+ | R3.1 29.31,41.78 29.62,42.09
TPOUT_N
  Top 0.254: R5.2 21.11,43.71 | 21.11,43.71 21.11,51.92 20.27,52.76 20.27,54.79 20.57,55.09 22.55,55.09 22.84,54.81 RJ1.TD- | 21.11,43.71 21.11,39.29 20.74,38.91 IC4.P$16
TPOUT_P
  Top 0.254: 21.57,41.68 21.57,39.1 20.73,38.27 IC4.P$17 | R4.1 21.57,41.68 | 21.57,41.68 21.57,45.56 arc-90 21.95,45.95 23.23,45.95 arc90 23.61,46.33 23.61,46.34 arc90 23.23,46.72 21.95,46.72 arc-90 21.57,47.1 21.57,47.11 arc-90 21.95,47.49 23.23,47.49 arc90 23.61,47.87 23.61,47.88 arc90 23.23,48.26 21.95,48.26 arc-90 21.57,48.64 RJ1.TD+
TXD
  Top 0.305: U$1.7 45.4,31.5 42.67,28.78 42.67,24 41.91,23.24 40.89,23.24 40.08,22.43 40.08,19.51 39.37,18.8 37.72,18.8 36.27,20.24 JP2.2
VBUS
  Top 0.305: C8.1 57.96,43.18
  Top 0.406: U$1.15 49.95,47.25 50.75,48.06 | D1.C 48.25,57.16 48.26,57.15
  Top 0.61: IC2.3 | C35.+ X3.1 C27.1 48.26,52.63 | 48.26,52.63 49.69,52.63 50.75,51.56 50.75,48.06 JP5.6 | 48.26,57.15 48.26,52.63 | IC5.6 C30.1 | 57.96,48.05 C7.+
  Top 0.813: 57.96,43.18 IC2.3 | F3.2 48.26,57.15 | IC5.6 66.67,56.52 65.74,55.59 R25.1 | JP5.6 C7.+ | C8.1 57.96,48.05
  Top 1.016: D1.C 53.21,57.28 54.92,55.58 C11.+ 63.54,55.58
  Top 1.27: 63.54,55.58 R25.1